# EAGLE design DAC2 (EAGLE 7.6.0)
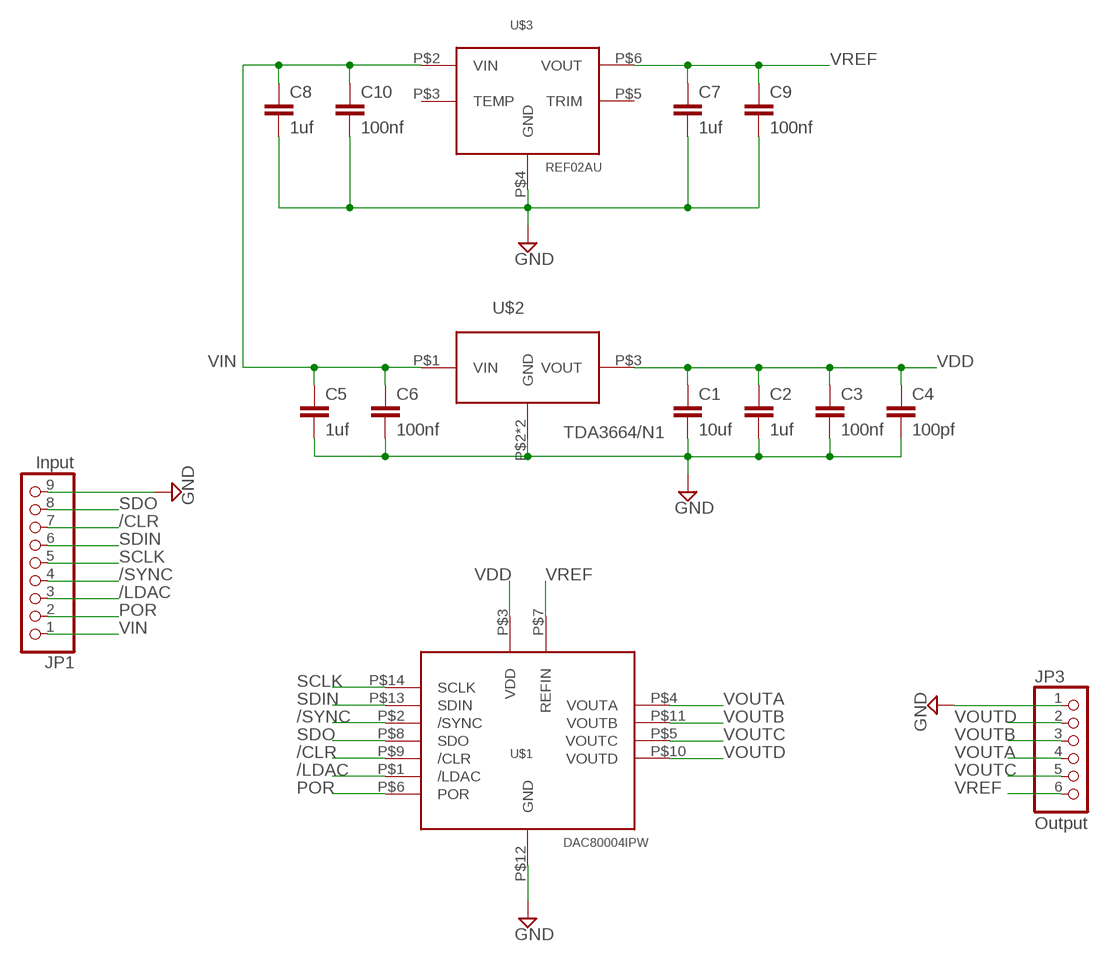
[diagram p0: schematic, sheet 1]

## Parts
C1  10uf  C-EUC1210  [C1210]
C2  1uf  C-EUC0603  [C0603]
C3  100nf  C-EUC0603  [C0603]
C4  100pf  C-EUC0603  [C0603]
C5  1uf  C-EUC0603  [C0603]
C6  100nf  C-EUC0603  [C0603]
C7  1uf  C-EUC0603  [C0603]
C8  1uf  C-EUC0603  [C0603]
C9  100nf  C-EUC0603  [C0603]
C10  100nf  C-EUC0603  [C0603]
JP1  Input  PINHD-1X9  [1X09]
JP3  Output  PINHD-1X6  [1X06]
U$1  DAC80004IPW  [TSSOP14]
U$2  TDA3664/N1  [SOT223]
U$3  REF02AU  [SO8]

## Nets
/CLR: JP1.7 U$1.P$9(/CLR)
/LDAC: JP1.3 U$1.P$1(/LDAC)
/SYNC: JP1.4 U$1.P$2(/SYNC)
GND: C1.2 C2.2 C3.2 C4.2 C5.2 C6.2 C7.2 C8.2 C9.2 C10.2 JP1.9 JP3.1 U$1.P$12(GND) U$2.P$2(GND) U$2.P$4(GND) U$3.P$4(GND)
POR: JP1.2 U$1.P$6(POR)
SCLK: JP1.5 U$1.P$14(SCLK)
SDIN: JP1.6 U$1.P$13(SDIN)
SDO: JP1.8 U$1.P$8(SDO)
VDD: C1.1 C2.1 C3.1 C4.1 U$1.P$3(VDD) U$2.P$3(VOUT)
VIN: C5.1 C6.1 C8.1 C10.1 JP1.1 U$2.P$1(VIN) U$3.P$2(VIN)
VOUTA: JP3.4 U$1.P$4(VOUTA)
VOUTB: JP3.3 U$1.P$11(VOUTB)
VOUTC: JP3.5 U$1.P$5(VOUTC)
VOUTD: JP3.2 U$1.P$10(VOUTD)
VREF: C7.1 C9.1 JP3.6 U$1.P$7(REFIN) U$3.P$6(VOUT)
Unconnected: U$3.P$3(TEMP) U$3.P$5(TRIM)

## Library data of the parts
C1-C10 = resistor:C-EU: CAPACITOR, European symbol
JP1 = pinhead:PINHD-1X9: PIN HEADER
JP3 = pinhead:PINHD-1X6: PIN HEADER
U$1 = DAC80004:DAC80004IPW
U$2 = TDA3664:TDA3664/N1
U$3 = REF02:REF02AU

## Board
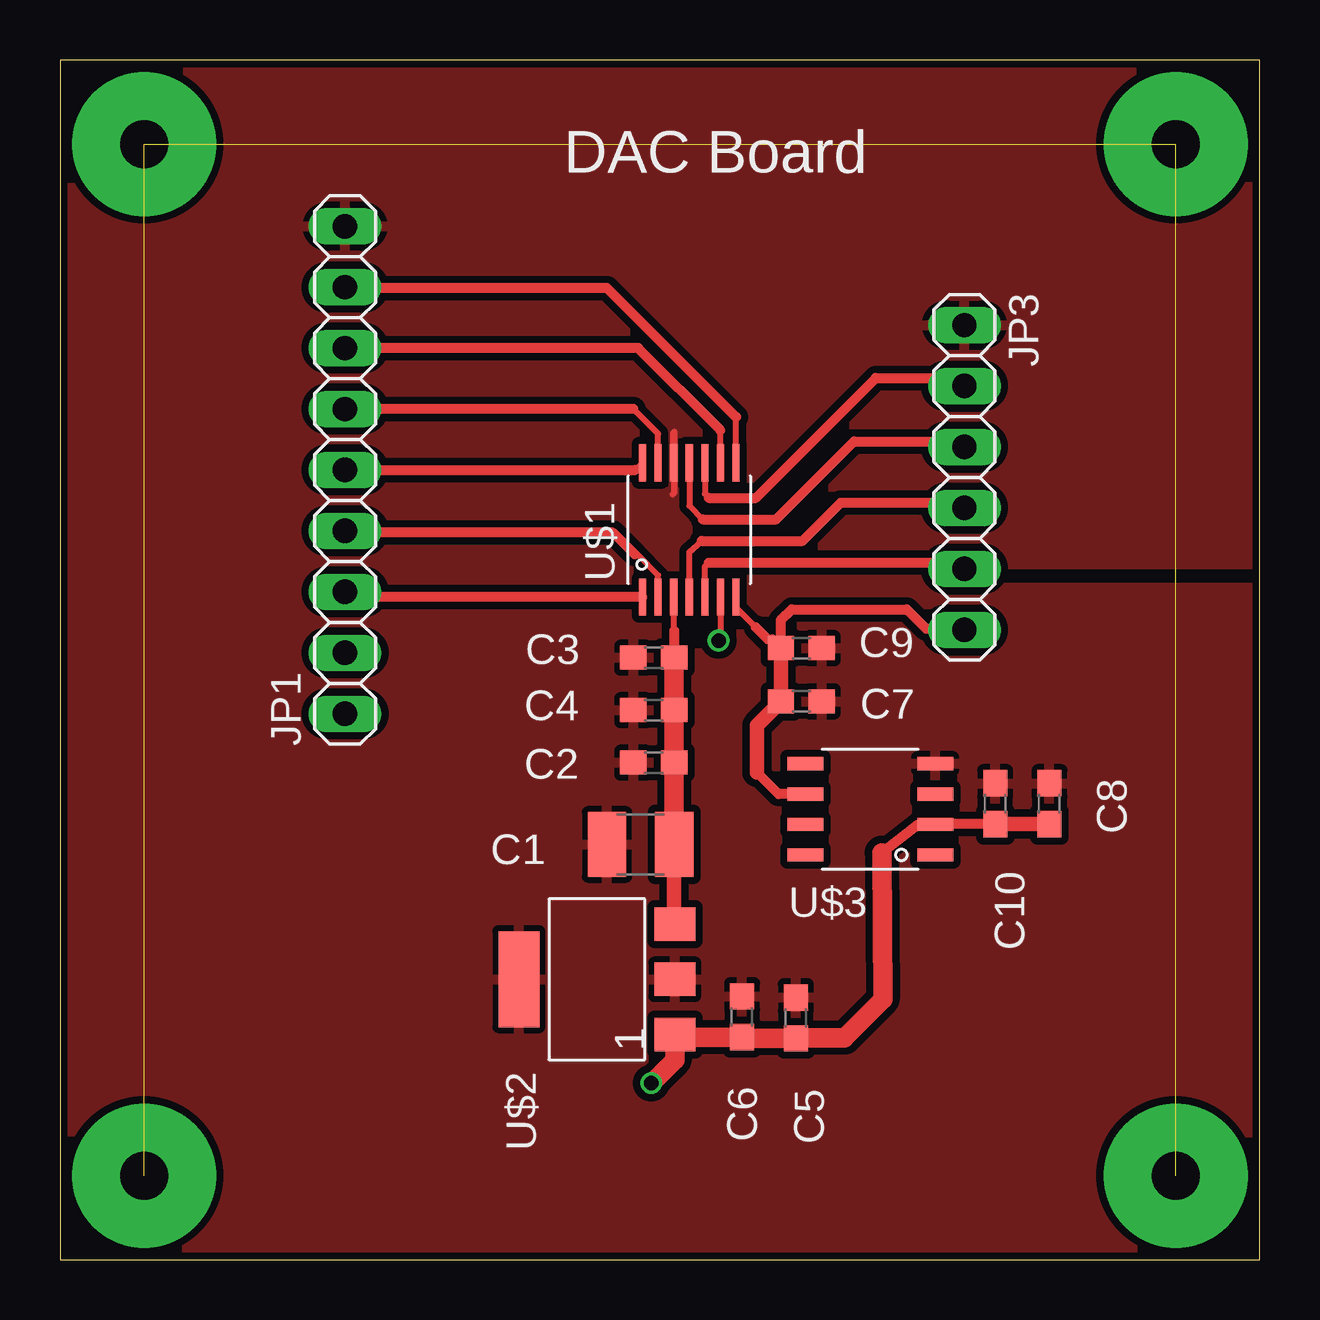
[diagram p1: board, top side]
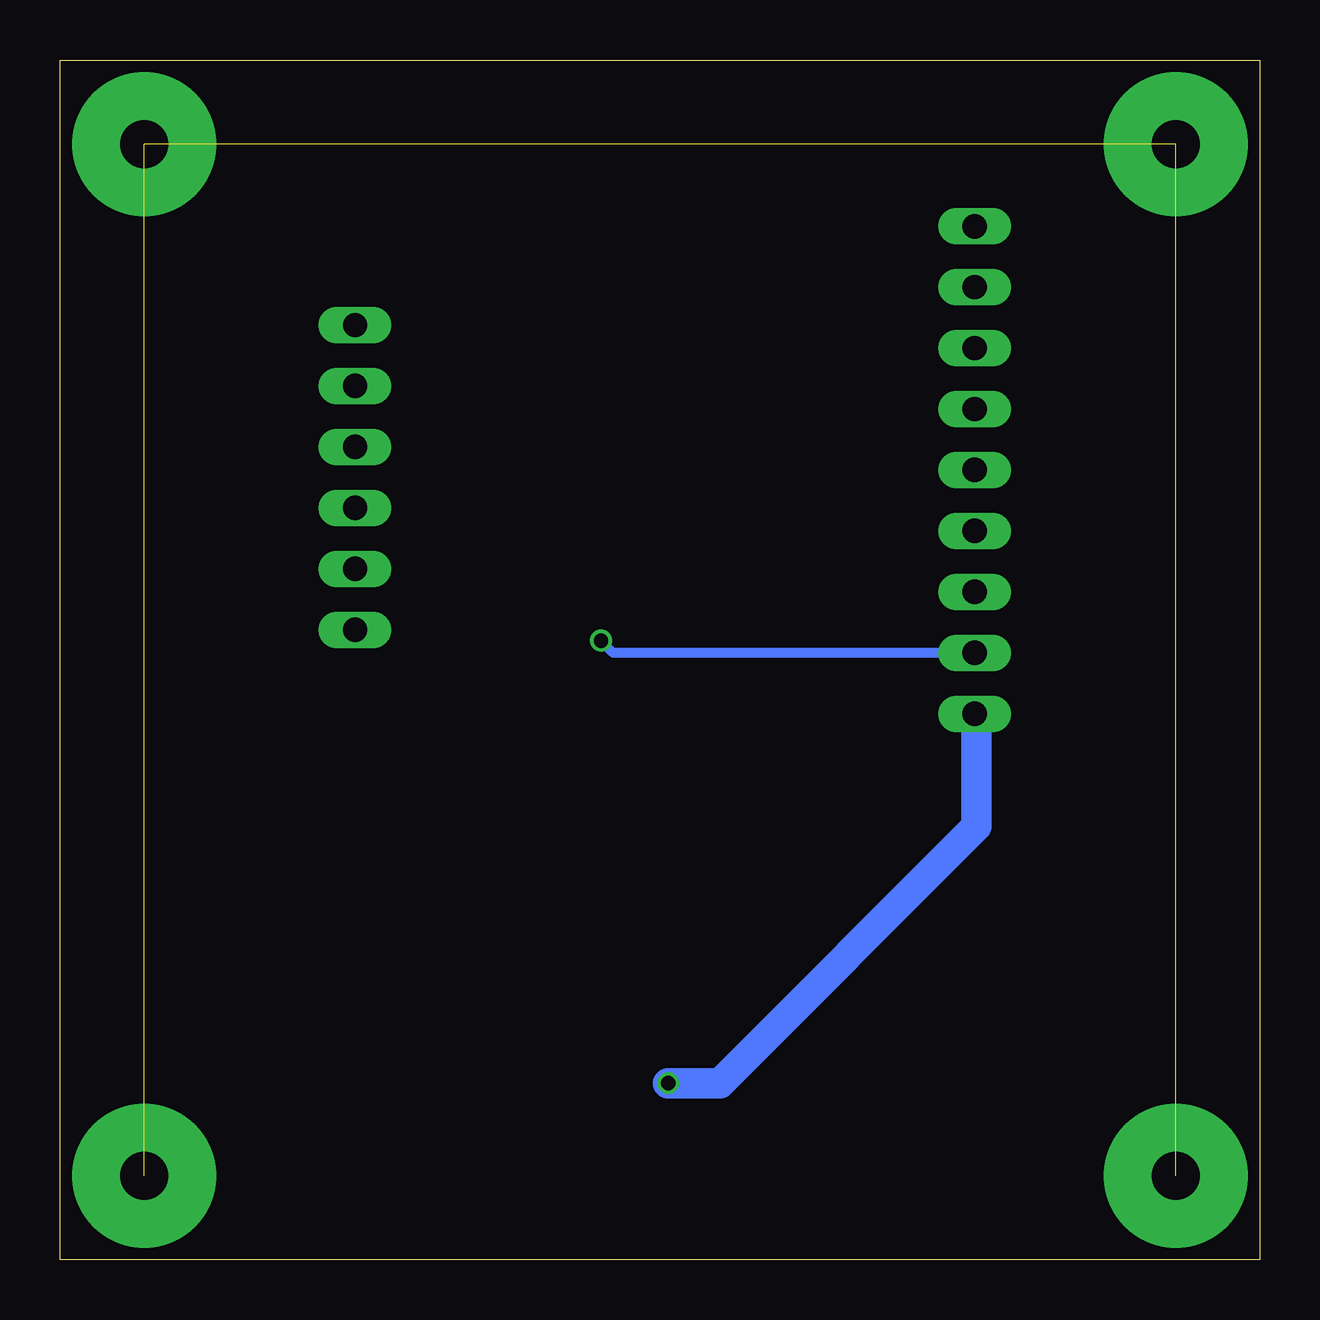
[diagram p2: board, bottom side, seen from below]

Size 50 x 50 mm. Coordinates in mm from the lower left corner, seen from the top.
Outline: 0,0 50,0 50,50 0,50 0,0
Copper layers (1*16): Top 0.035mm / dielectric 1.5mm / Bottom 0.035mm
Design rules "ITead_rule": minimum track width 6mil, minimum drill 12mil, track to track 6mil, track to pad 6mil, pad to pad 6mil, via to via 6mil, smd to smd 0mil, copper to edge 10mil, drill to drill 10mil, minimum pad ring 10mil, minimum via ring 6mil, stop-mask expansion 2mil, vias tented up to drill 100mil, thermal gap 10mil

### Footprints (pad centres in the part's own frame; a part is rotated, then mirrored left to right if it is on the bottom)
C1210 = smd 1.6 x 2.7: 1 -1.4,0; 2 1.4,0
C0603 = smd 1.1 x 1: 1 -0.85,0; 2 0.85,0
1X09 = drill 1.016 long: 1 -10.16,0; 2 -7.62,0; 3 -5.08,0; 4 -2.54,0; 5 0,0; 6 2.54,0; 7 5.08,0; 8 7.62,0; 9 10.16,0
1X06 = drill 1.016 long: 1 -6.35,0; 2 -3.81,0; 3 -1.27,0; 4 1.27,0; 5 3.81,0; 6 6.35,0
TSSOP14 = smd 1.55 x 0.3: P$1 -2.8,1.95; P$2 -2.8,1.3; P$3 -2.8,0.65; P$4 -2.8,0; P$5 -2.8,-0.65; P$6 -2.8,-1.3; P$7 -2.8,-1.95; P$8 2.8,-1.95; P$9 2.8,-1.3; P$10 2.8,-0.65; P$11 2.8,0; P$12 2.8,0.65; P$13 2.8,1.3; P$14 2.8,1.95
SOT223 = smd 1.4 x 1.7: P$1 -2.3,-3.25; P$2 0,-3.25; P$3 2.3,-3.25 | smd 4 x 1.7: P$4 0,3.25
SO8 = smd 1.5 x 0.55: P$1 -2.7,2.54; P$2 -2.7,1.27; P$3 -2.7,0; P$4 -2.7,-1.27; P$5 2.7,-1.27; P$6 2.7,0; P$7 2.7,1.27; P$8 2.7,2.54

### Placement (x,y rotation side)
C1  24.2,17.3 180 top
C2  24.75,20.71 180 top
C3  24.75,25.09 180 top
C4  24.75,22.9 180 top
C5  30.67,10.07 90 top
C6  28.43,10.12 90 top
C7  30.9,23.27 0 top
C8  41.24,19 90 top
C9  30.9,25.48 0 top
C10  38.98,19 90 top
JP1  11.88,32.91 90 top
JP3  37.7,32.6 270 top
U$1  26.23,30.41 90 top
U$2  22.38,11.68 90 top
U$3  33.78,19.4 180 top

### Tracks (layer width: path | path; a pad name or v marks a point on that pad's centre or on a via)
/CLR
  Top 0.254: U$1.P$9 27.53,34.57 | 10.79,38 JP1.7
  Top 0.406: 27.53,34.57 24.1,38 10.79,38
/LDAC
  Top 0.254: 11,27.61 JP1.3
  Top 0.406: U$1.P$1 11,27.61
/SYNC
  Top 0.254: U$1.P$2 24.93,28.52 24.05,29.4 23.95,29.4 | 10.85,30.3 JP1.4
  Top 0.406: 23.95,29.4 23.05,30.3 10.85,30.3
GND
  Top 0.254: U$1.P$12 25.58,34.48 25.6,34.5 25.6,31.95 25.55,31.9
  pour Top (isolate 0.305): 0,0 50,0 50,28 36.5,28 36.5,29 50,29 50,50 0,50
N$1  (via drill 2 pad 6)  (3 unrouted)
  other vias: 3.5,46.5 46.5,46.5 46.5,3.5 3.5,3.5
POR  (via drill 0.6)
  Top 0.254: 27.55,26 27.55,27.59 U$1.P$6
  Top 0.406: v27.45,25.8 27.45,25.9 27.55,26
  Bottom 0.406: JP1.2 26.94,25.29 v27.45,25.8
SCLK
  Top 0.254: 23.98,32.91 U$1.P$14
  Top 0.406: JP1.5 23.98,32.91
SDIN
  Top 0.254: U$1.P$13 24.93,34.42 23.9,35.45
  Top 0.406: 23.9,35.45 JP1.6
SDO
  Top 0.254: U$1.P$8 28.18,35.12 | 10.81,40.5 JP1.8
  Top 0.406: 28.18,35.12 22.8,40.5 10.81,40.5
VDD
  Top 0.254: U$1.P$3 25.58,26.22 25.6,26.2
  Top 0.406: 25.6,26.2 C3.1 | 25.6,14.01 U$2.P$3
  Top 0.61: C1.1 25.6,14.01
  Top 0.813: C3.1 C4.1 C2.1 C1.1
VIN  (via drill 0.6)
  Top 0.406: C10.1 36.5,18.15 U$3.P$2 35.78,18.13 34.25,16.95 | 30.7,9.25 C5.1 | 28.48,9.22 C6.1 | 25.74,9.27 U$2.P$1
  Top 0.61: C8.1 C10.1
  Top 0.813: 34.25,16.95 34.3,10.85 32.7,9.25 30.7,9.25 | C5.1 28.48,9.22 | C6.1 25.74,9.27 | U$2.P$1 25.63,8.33 v24.65,7.35
  Bottom 0.406: 11.8,22.67 JP1.1
  Bottom 1.27: v24.65,7.35 22.5,7.35 11.8,18.05 11.8,22.67
VOUTA
  Top 0.254: U$1.P$4 26.23,29.48 26.75,29.95
  Top 0.406: 26.75,29.95 30.95,29.95 32.55,31.55 37.7,31.55 JP3.4
VOUTB
  Top 0.254: U$1.P$11 26.23,31.42 26.8,30.85
  Top 0.406: 26.8,30.85 29.85,30.85 33.1,34.1 37.7,34.1 JP3.3
VOUTC
  Top 0.254: U$1.P$5 26.88,28.88 27.05,29.05
  Top 0.406: 27.05,29.05 37.7,29.05 JP3.5
VOUTD
  Top 0.254: U$1.P$10 26.88,31.92 27.05,31.75
  Top 0.406: 27.05,31.75 29,31.75 34,36.75 37.7,36.75 JP3.2
VREF
  Top 0.254: U$1.P$7 28.18,27.17 29,26.35
  Top 0.406: U$3.P$6 29.95,19.4 29.05,20.3 | 29,26.35 29.5,25.85 29.68,25.85 C9.1 30.05,26.65 30.5,27.1 35.3,27.1 36.1,26.3 37.65,26.3 JP3.6
  Top 0.61: C9.1 C7.1 29.05,22.27 29.05,20.3

### Text on the board
tPlace: DAC Board